# Altium schematic sheet Driver Circuit.SchDoc
size A3; DocumentNumber: 1; SheetNumber: 1; SheetTotal: 1
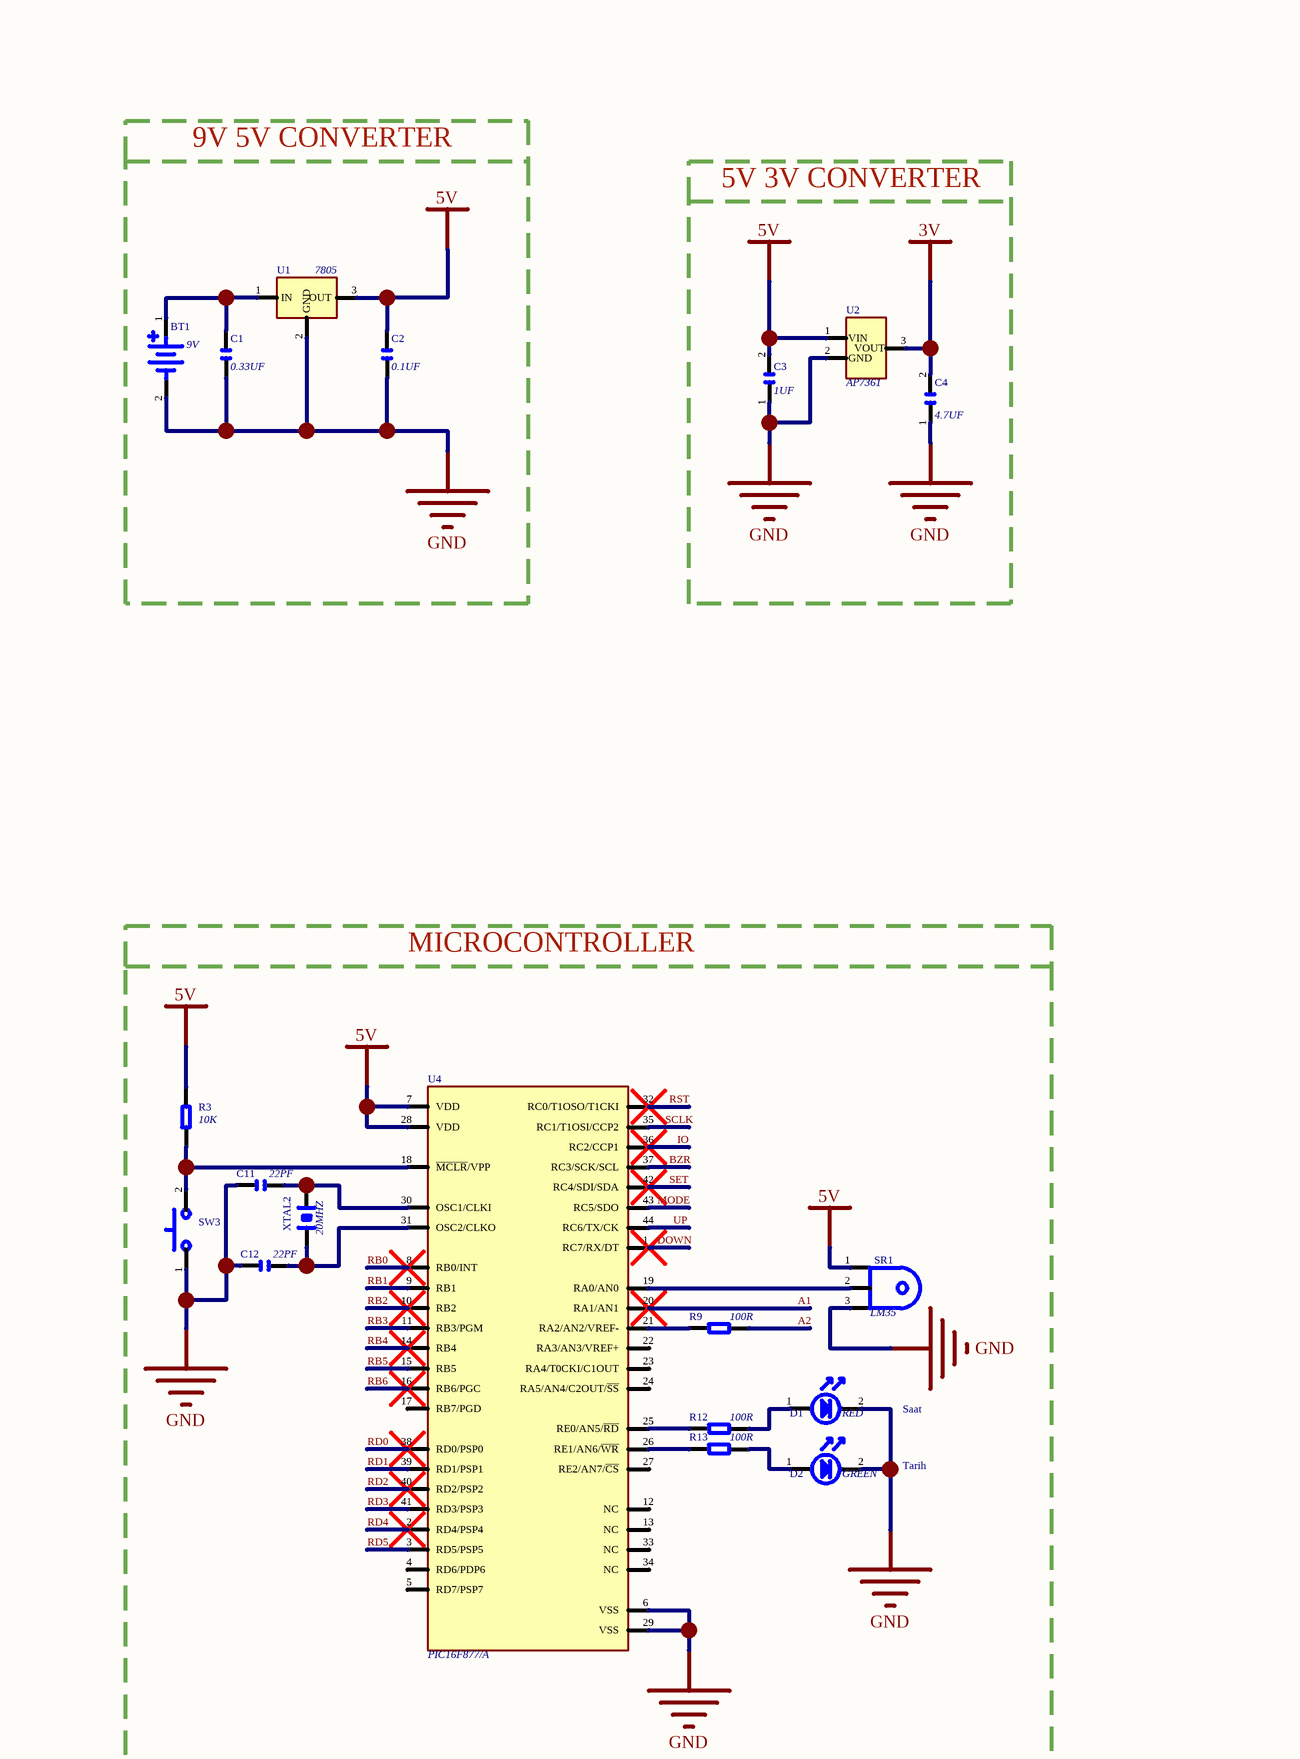
[diagram p0: Driver Circuit.SchDoc, top left]
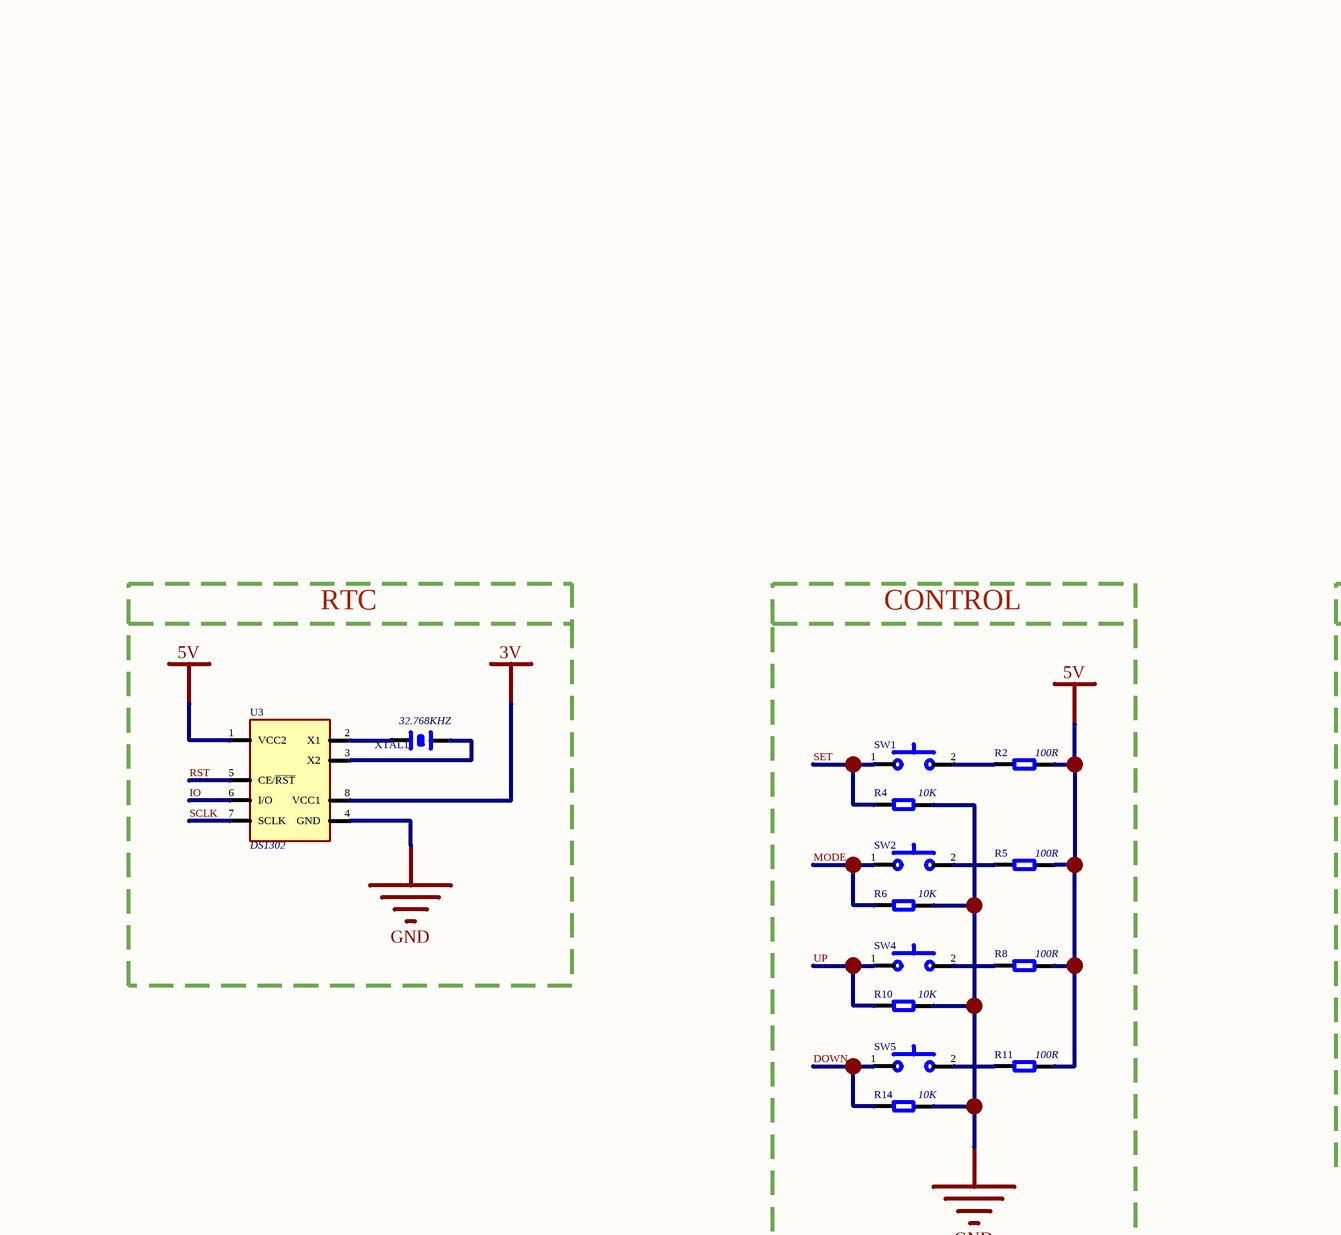
[diagram p1: Driver Circuit.SchDoc, top middle]
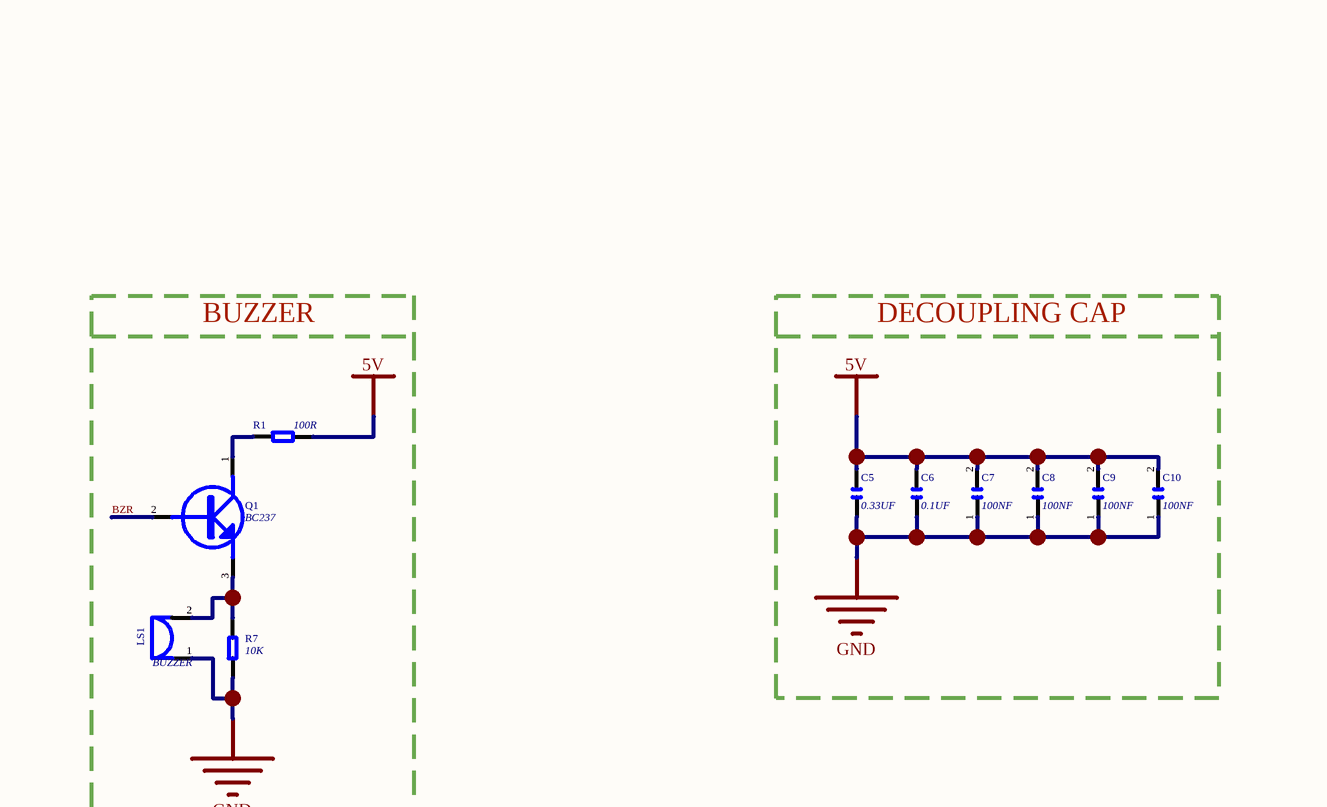
[diagram p2: Driver Circuit.SchDoc, top right]
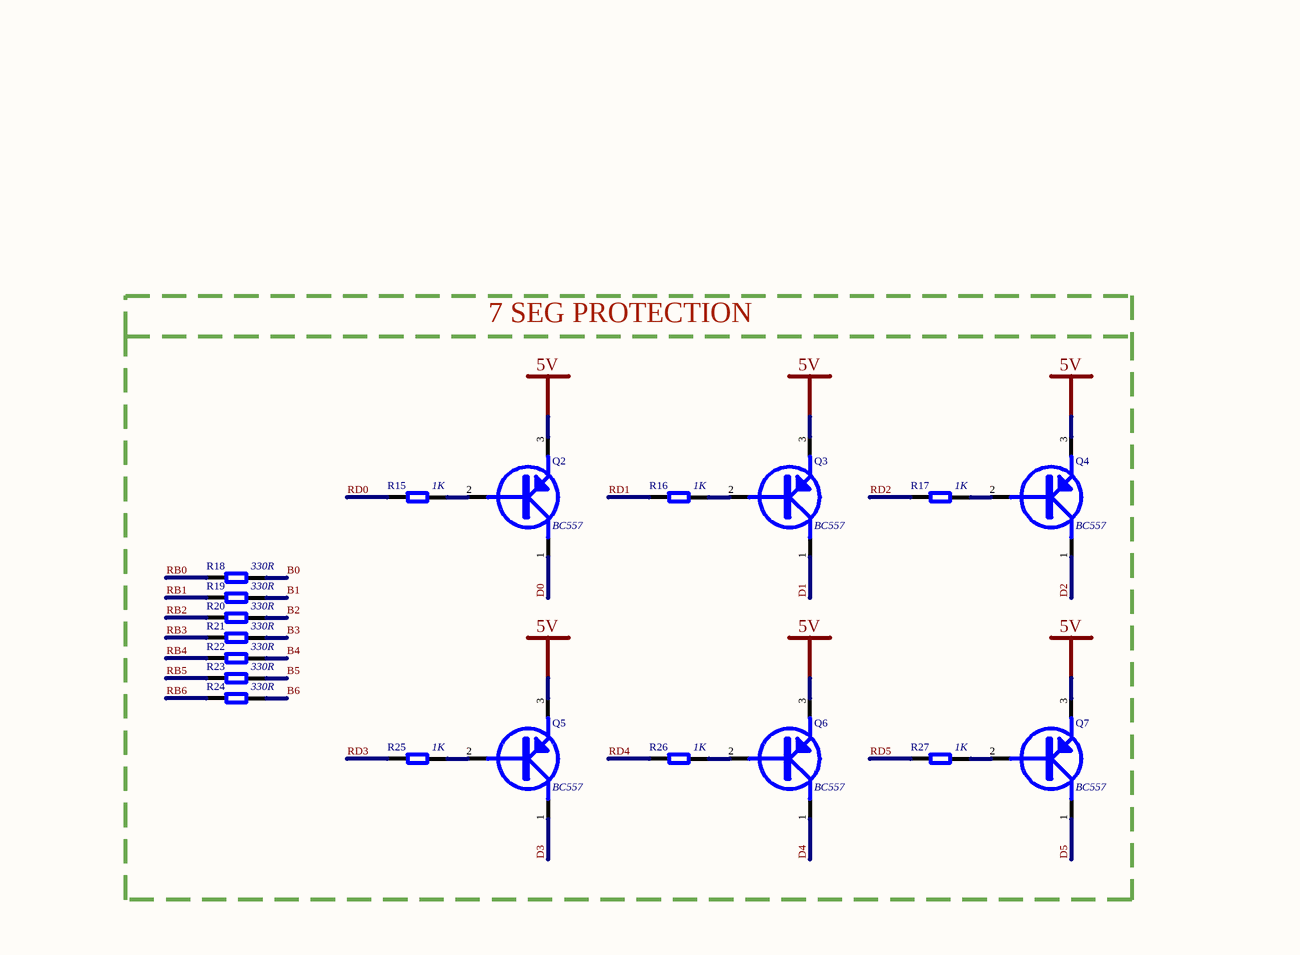
[diagram p3: Driver Circuit.SchDoc, centre left]
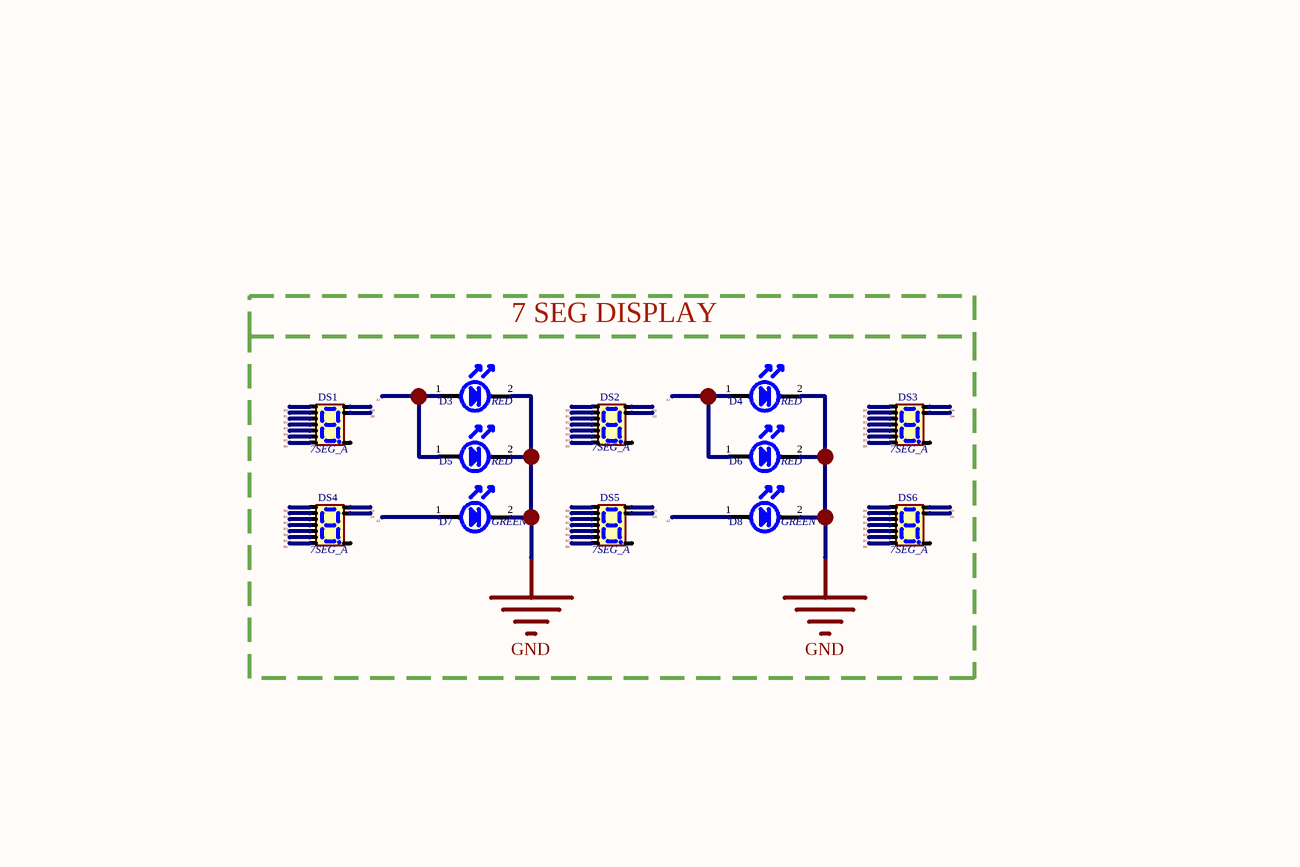
[diagram p4: Driver Circuit.SchDoc, centre middle]
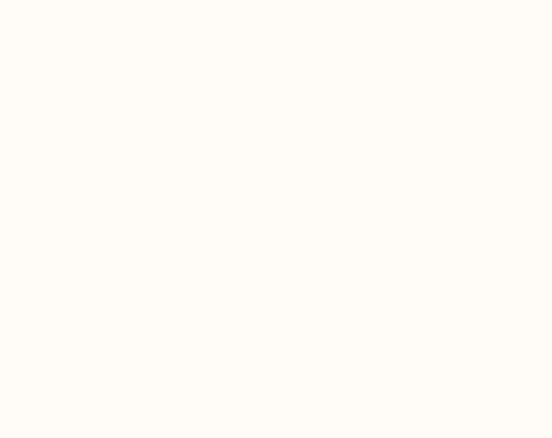
[diagram p5: Driver Circuit.SchDoc, bottom left]

## Parts
BT1  value 9V  [BATTERY_9V]  (hidden comment: BH9VPC & 6LF22XWA/B)
C1  Capacitor: 0.33UF  [CAP_0603]  (hidden comment: GRM033R60J334ME90D)
C2  Capacitor: 0.1UF  [CAP_0603]  (hidden comment: GRM033R60J104KE19D)
C3  Capacitor: 1UF  [CAP_0805]  (hidden comment: CL21B105KBFNNNE)
C4  Capacitor: 4.7UF  [CAP_0805]  (hidden comment: CL21A475KAQNNNE)
C5  Capacitor: 0.33UF  [CAP_0603]  (hidden comment: GRM033R60J334ME90D)
C6  Capacitor: 0.1UF  [CAP_0603]  (hidden comment: GRM033R60J104KE19D)
C7  Capacitor: 100NF  [CAP_0603]  (hidden comment: C0603C104K5RACTU)
C8  Capacitor: 100NF  [CAP_0603]  (hidden comment: C0603C104K5RACTU)
C9  Capacitor: 100NF  [CAP_0603]  (hidden comment: C0603C104K5RACTU)
C10  Capacitor: 100NF  [CAP_0603]  (hidden comment: C0603C104K5RACTU)
C11  Capacitor: 22PF  [CAP_0603]  (hidden comment: GRM0335C1H220JA01D)
C12  Capacitor: 22PF  [CAP_0603]  (hidden comment: GRM0335C1H220JA01D)
D1  Diode: RED  [LED RED_0805]  (hidden comment: LTST-C170KRKT)
D2  Diode: GREEN  [LED GREEN_0805]  (hidden comment: LTST-C171GKT)
D3  Diode: RED  [LED RED_0805]  (hidden comment: LTST-C170KRKT)
D4  Diode: RED  [LED RED_0805]  (hidden comment: LTST-C170KRKT)
D5  Diode: RED  [LED RED_0805]  (hidden comment: LTST-C170KRKT)
D6  Diode: RED  [LED RED_0805]  (hidden comment: LTST-C170KRKT)
D7  Diode: GREEN  [LED GREEN_0805]  (hidden comment: LTST-C171GKT)
D8  Diode: GREEN  [LED GREEN_0805]  (hidden comment: LTST-C171GKT)
DS1  value 7SEG_A  [7 SEG_CA_SMD_ACSX03-41]  (hidden comment: ACSA03-41SURKWA-F01)
DS2  value 7SEG_A  [7 SEG_CA_SMD_ACSX03-41]  (hidden comment: ACSA03-41SURKWA-F01)
DS3  value 7SEG_A  [7 SEG_CA_SMD_ACSX03-41]  (hidden comment: ACSA03-41SURKWA-F01)
DS4  value 7SEG_A  [7 SEG_CA_SMD_ACSX03-41]  (hidden comment: ACSA03-41SURKWA-F01)
DS5  value 7SEG_A  [7 SEG_CA_SMD_ACSX03-41]  (hidden comment: ACSA03-41SURKWA-F01)
DS6  value 7SEG_A  [7 SEG_CA_SMD_ACSX03-41]  (hidden comment: ACSA03-41SURKWA-F01)
LS1  value BUZZER  [BUZZER_5V]  (hidden comment: AI-1027-TWT-5V-R)
Q1  value BC237  [TO-92]  (hidden comment: BC237G)
Q2  value BC557  [TO-92-3]  (hidden comment: BC557BTA)
Q3  value BC557  [TO-92-3]  (hidden comment: BC557BTA)
Q4  value BC557  [TO-92-3]  (hidden comment: BC557BTA)
Q5  value BC557  [TO-92-3]  (hidden comment: BC557BTA)
Q6  value BC557  [TO-92-3]  (hidden comment: BC557BTA)
Q7  value BC557  [TO-92-3]  (hidden comment: BC557BTA)
R1  Resistor: 100R  [RES_0603]  (hidden comment: RC0603JR-07100RL)
R2  Resistor: 100R  [RES_0603]  (hidden comment: RC0603JR-07100RL)
R3  Resistor: 10K  [RES_0603]  (hidden comment: RC0603FR-0710KL)
R4  Resistor: 10K  [RES_0603]  (hidden comment: RC0603FR-0710KL)
R5  Resistor: 100R  [RES_0603]  (hidden comment: RC0603JR-07100RL)
R6  Resistor: 10K  [RES_0603]  (hidden comment: RC0603FR-0710KL)
R7  Resistor: 10K  [RES_0603]  (hidden comment: RC0603FR-0710KL)
R8  Resistor: 100R  [RES_0603]  (hidden comment: RC0603JR-07100RL)
R9  Resistor: 100R  [RES_0603]  (hidden comment: RC0603JR-07100RL)
R10  Resistor: 10K  [RES_0603]  (hidden comment: RC0603FR-0710KL)
R11  Resistor: 100R  [RES_0603]  (hidden comment: RC0603JR-07100RL)
R12  Resistor: 100R  [RES_0603]  (hidden comment: RC0603JR-07100RL)
R13  Resistor: 100R  [RES_0603]  (hidden comment: RC0603JR-07100RL)
R14  Resistor: 10K  [RES_0603]  (hidden comment: RC0603FR-0710KL)
R15  Resistor: 1K  [RES_0603]  (hidden comment: RC0603FR-071KL)
R16  Resistor: 1K  [RES_0603]  (hidden comment: RC0603FR-071KL)
R17  Resistor: 1K  [RES_0603]  (hidden comment: RC0603FR-071KL)
R18  Resistor: 330R  [RES_0603]  (hidden comment: RC0603JR-07330RL)
R19  Resistor: 330R  [RES_0603]  (hidden comment: RC0603JR-07330RL)
R20  Resistor: 330R  [RES_0603]  (hidden comment: RC0603JR-07330RL)
R21  Resistor: 330R  [RES_0603]  (hidden comment: RC0603JR-07330RL)
R22  Resistor: 330R  [RES_0603]  (hidden comment: RC0603JR-07330RL)
R23  Resistor: 330R  [RES_0603]  (hidden comment: RC0603JR-07330RL)
R24  Resistor: 330R  [RES_0603]  (hidden comment: RC0603JR-07330RL)
R25  Resistor: 1K  [RES_0603]  (hidden comment: RC0603FR-071KL)
R26  Resistor: 1K  [RES_0603]  (hidden comment: RC0603FR-071KL)
R27  Resistor: 1K  [RES_0603]  (hidden comment: RC0603FR-071KL)
SR1  value LM35  [TO-92-3]  (hidden comment: LM35DZ/NOPB)
SW1  PTS526 SMG15 SMTR2 LFS  [BUTTON_SMD_PTS526-SMG15]  (value not drawn)
SW2  PTS526 SMG15 SMTR2 LFS  [BUTTON_SMD_PTS526-SMG15]  (value not drawn)
SW3  PTS526 SMG15 SMTR2 LFS  [BUTTON_SMD_PTS526-SMG15]  (value not drawn)
SW4  PTS526 SMG15 SMTR2 LFS  [BUTTON_SMD_PTS526-SMG15]  (value not drawn)
SW5  PTS526 SMG15 SMTR2 LFS  [BUTTON_SMD_PTS526-SMG15]  (value not drawn)
U1  value 7805  [7805_D2PAK_CD2T]  (hidden comment: L7805ACD2T-TR)
U2  value AP7361  [SOT-223]  (hidden comment: AP7361-33E-13)
U3  value DS1302  [SOIC-8]  (hidden comment: DS1302Z+T&R)
U4  value PIC16F877/A  [TQFP-44]  (hidden comment: PIC16F877-20/PT)
XTAL1  Crystal: 32.768KHZ  [ABS05]  (hidden comment: ABS05-32.768KHZ-T)
XTAL2  Crystal: 20MHZ  [CRYSTAL_2 SMD]  (hidden comment: ECS-200-20-23A-EN-TR)

## Blocks framed on the sheet
9V 5V CONVERTER: BT1 C1 C2 U1
5V 3V CONVERTER: C3 C4 U2
MICROCONTROLLER: C11 C12 D1 D2 R3 R9 R12 R13 SR1 SW3 U4 XTAL2
RTC: U3 XTAL1
CONTROL: R2 R4-R6 R8 R10 R11 R14 SW1 SW2 SW4 SW5
BUZZER: LS1 Q1 R1 R7
DECOUPLING CAP: C5-C10
7 SEG PROTECTION: Q2-Q7 R15-R27
7 SEG DISPLAY: D3-D8 DS1-DS6

## Nets
3V: C4.2 U2.3(VOUT) U3.8(VCC1)
5V: C2.2 C3.2 C5.2 C6.2 C7.2 C8.2 C9.2 C10.2 Q2.3(E) Q3.3(E) Q4.3(E) Q5.3(E) Q6.3(E) Q7.3(E) R1.2 R2.2 R3.2 R5.2 R8.2 R11.2 SR1.1(VIN) U1.3(OUT) U2.1(VIN) U3.1(VCC2) U4.7(VDD) U4.28(VDD)
GND: BT1.2(-) C1.1 C2.1 C3.1 C4.1 C5.1 C6.1 C7.1 C8.1 C9.1 C10.1 C11.1 C12.1 D1.2 D2.2 D3.2 D4.2 D5.2 D6.2 D7.2 D8.2 LS1.1(+) R4.2 R6.2 R7.1 R10.2 R14.2 SR1.3(GND) SW3.1 U1.2(GND) U2.2(GND) U3.4(GND) U4.6(VSS) U4.29(VSS)
A1: D3.1 D4.1 D5.1 D6.1 U4.20(RA1/AN1)
A2: D7.1 D8.1 R9.2
B0: DS1.A DS2.A DS3.A DS4.A DS5.A DS6.A R18.2
B1: DS1.B DS2.B DS3.B DS4.B DS5.B DS6.B R19.2
B2: DS1.C DS2.C DS3.C DS4.C DS5.C DS6.C R20.2
B3: DS1.D DS2.D DS3.D DS4.D DS5.D DS6.D R21.2
B4: DS1.E DS2.E DS3.E DS4.E DS5.E DS6.E R22.2
B5: DS1.F DS2.F DS3.F DS4.F DS5.F DS6.F R23.2
B6: DS1.G DS2.G DS3.G DS4.G DS5.G DS6.G R24.2
BZR: Q1.2(B) U4.37(RC3/SCK/SCL)
D0: DS1.VCC Q2.1(C)
D1: DS4.VCC Q3.1(C)
D2: DS2.VCC Q4.1(C)
D3: DS5.VCC Q5.1(C)
D4: DS3.VCC Q6.1(C)
D5: DS6.VCC Q7.1(C)
DOWN: R14.1 SW5.1 U4.1(RC7/RX/DT)
IO: U3.6(I/O) U4.36(RC2/CCP1)
MODE: R6.1 SW2.1 U4.43(RC5/SDO)
RB0: R18.1 U4.8(RB0/INT)
RB1: R19.1 U4.9(RB1)
RB2: R20.1 U4.10(RB2)
RB3: R21.1 U4.11(RB3/PGM)
RB4: R22.1 U4.14(RB4)
RB5: R23.1 U4.15(RB5)
RB6: R24.1 U4.16(RB6/PGC)
RD0: R15.1 U4.38(RD0/PSP0)
RD1: R16.1 U4.39(RD1/PSP1)
RD2: R17.1 U4.40(RD2/PSP2)
RD3: R25.1 U4.41(RD3/PSP3)
RD4: R26.1 U4.2(RD4/PSP4)
RD5: R27.1 U4.3(RD5/PSP5)
RST: U3.5(CE/~{RST}) U4.32(RC0/T1OSO/T1CKI)
SCLK: U3.7(SCLK) U4.35(RC1/T1OSI/CCP2)
SET: R4.1 SW1.1 U4.42(RC4/SDI/SDA)
UP: R10.1 SW4.1 U4.44(RC6/TX/CK)
NetBT1_1: BT1.1(+) C1.2 U1.1(IN)
NetC11_2: C11.2 U4.30(OSC1/CLKI) XTAL2.2
NetC12_2: C12.2 U4.31(OSC2/CLKO) XTAL2.1
NetD1_1: D1.1 R12.2
NetD2_1: D2.1 R13.2
NetLS1_2: LS1.2(-) Q1.3(E) R7.2
NetQ1_1: Q1.1(C) R1.1
NetQ2_2: Q2.2(B) R15.2
NetQ3_2: Q3.2(B) R16.2
NetQ4_2: Q4.2(B) R17.2
NetQ5_2: Q5.2(B) R25.2
NetQ6_2: Q6.2(B) R26.2
NetQ7_2: Q7.2(B) R27.2
NetR2_1: R2.1 SW1.2
NetR3_1: R3.1 SW3.2 U4.18(~{MCLR}/VPP)
NetR5_1: R5.1 SW2.2
NetR8_1: R8.1 SW4.2
NetR9_1: R9.1 U4.21(RA2/AN2/VREF-)
NetR11_1: R11.1 SW5.2
NetR12_1: R12.1 U4.25(RE0/AN5/~{RD})
NetR13_1: R13.1 U4.26(RE1/AN6/~{WR})
NetSR1_2: SR1.2(VOUT) U4.19(RA0/AN0)
NetU3_2: U3.2(X1) XTAL1.1
NetU3_3: U3.3(X2) XTAL1.2

Not connected (* = marked no-connect by the designer): DS1 DP; DS2 DP; DS3 DP; DS4 DP; DS5 DP; DS6 DP; U4 4(RD6/PDP6) 5(RD7/PSP7) 12(NC) 13(NC) 17(RB7/PGD) 22(RA3/AN3/VREF+) 23(RA4/T0CKI/C1OUT) 24(RA5/AN4/C2OUT/~{SS}) 27(RE2/AN7/~{CS}) 33(NC) 34(NC)

## Notes on the sheet
- Saat
- Tarih
- Tanım/Description
- Hazırlayan/Prepared By
- Kontrol Eden/Checked By
- Değiştirme Tarihi/Change Date
- Yayın Tarihi/Release Date
- Mehmet Ali
- Onaylayan/Approved By
- Revizyon/Revision
- Hayta
- Bölüm/Department
- Dosya Adı/File Name
- Electronics&Hardware
- Boyut/Size
- Sayfa/Sheet
- A-3
- /

## Library data of the parts
BT1 = BATTERY_9V: Battery Holder (Open) 9V 1 Cell PC Pin &   9V Alkaline Manganese Dioxide 9 V Battery Non-Rechargeable (Primary); Manufacturer: Memory Protection Devices; Number of Cells: 1; Supplier 1: Digi-Key; Manufacturer Part Number: BH9VPC; RoHS: Yes; Category: Connectors; Stock 1: 5860; Pricing 1: 1=2,27000, 10=1,91300, 50=1,68160, 100=1,58450, 250=1,45744, 500=1,36774, 1000=1,27805, 2500=1,15847, 5000=1,06131 (USD); Mount: Surface Mount,PCB,Through Hole; Min Operating Temperature: -40°C; Max Operating Temperature: 270°C; Package Quantity: 100; Termination: SMD/SMT; ComponentLink1URL: https://datasheet.ciiva.com/3/bh9vpc-datasheet-3862.pdf?src-supplier=Digi-Key; ComponentLink1Description: https://datasheet.ciiva.com/3/bh9vpc-datasheet-3862.pdf?src-supplier=Digi-Key; Supplier 2: Digi-Key; Stock 2: 21288; Pricing 2: 1=1,98000, 20=1,64650, 210=1,35500, 420=1,26048, 630=1,18957, 1050=1,11868, 2520=1,04777 (USD); Weight: 45.59g; Chemistry/Technology: Alkaline; Packaging: Bulk; Output Voltage: 9V; Voltage Rating: 9V; Length: 1.91inch; Width: 0.51inch; Height: 0.69inch; Lead Free: Lead Free; ComponentLink2URL: http://www.mouser.com/ds/2/315/panasonic_alkaline_batteries_9v_series_6lf22xwa-541606.pdf?src-supplier=Mouser; ComponentLink2Description: http://www.mouser.com/ds/2/315/panasonic_alkaline_batteries_9v_series_6lf22xwa-541606.pdf?src-supplier=Mouser; ComponentLink3URL: https://na.industrial.panasonic.com/sites/default/pidsa/files/downloads/files/panasonic-6lf22xwa-datasheet.pdf?src-supplier=Digi-Key; ComponentLink3Description: https://na.industrial.panasonic.com/sites/default/pidsa/files/downloads/files/panasonic-6lf22xwa-datasheet.pdf?src-supplier=Digi-Key; Supplier Part Number 2: P687-ND; Supplier Part Number 1: BH9V-PC-ND
C1 C5 = 0603_CAP_CER  UF_0.33: CAP CER 0.33UF %20 0603 SMD; Manufacturer: Murata; Capacitance: 330nF; Tolerance: 20%; Dielectric: X5R; Voltage Rating (DC): 6.3V; Supplier 1: Digi-Key; Manufacturer Part Number: GRM033R60J334ME90D; RoHS: Yes; Category: Ceramic Capacitors; Stock 1: 1061917; Pricing 1: 1=0,12000, 10=0,08400, 50=0,04740, 100=0,03930, 500=0,02754, 1000=0,02280, 2500=0,02122, 5000=0,01941 (USD); Mount: Surface Mount; Case/Package: 0201; Case Code (Metric): 0603; Case Code (Imperial): 0201; Weight: 1.2E-05oz; Min Operating Temperature: -55°C; Max Operating Temperature: 85°C; Packaging: Tape and Reel; Voltage Rating: 6.3V; Termination: SMD/SMT; Package Quantity: 15000; Length: 0.024inch; Width: 0.012inch; Height: 0.3mm; Thickness: 0.013inch; RoHS Compliant: Yes; ComponentLink1URL: http://www.farnell.com/datasheets/2722735.pdf?src-supplier=Farnell; ComponentLink1Description: http://www.farnell.com/datasheets/2722735.pdf?src-supplier=Farnell; ComponentLink2URL: http://www.mouser.com/ds/2/281/c02e-2905.pdf?src-supplier=Mouser; ComponentLink2Description: http://www.mouser.com/ds/2/281/c02e-2905.pdf?src-supplier=Mouser; ComponentLink3URL: http://search.murata.co.jp/Ceramy/image/img/A01X/G101/ENG/GRM033R60J334ME90-01.pdf?src-supplier=Digi-Key; ComponentLink3Description: http://search.murata.co.jp/Ceramy/image/img/A01X/G101/ENG/GRM033R60J334ME90-01.pdf?src-supplier=Digi-Key; ComponentLink4URL: http://www.farnell.com/datasheets/2722735.pdf?src-supplier=Newark; ComponentLink4Description: http://www.farnell.com/datasheets/2722735.pdf?src-supplier=Newark; Supplier Part Number 1: 490-10408-1-ND
C2 C6 = 0603_CAP_CER  UF_0.1: CAP CER 0.1UF %10 0603 SMD; Manufacturer: Murata; Material: Ceramic; Tolerance: 10%; Capacitance: 100nF; Dielectric: X5R; Voltage Rating: 6.3V; Supplier 1: Digi-Key; Manufacturer Part Number: GRM033R60J104KE19D; RoHS: Yes; Category: Ceramic Capacitors; Stock 1: 25268944; Pricing 1: 1=0,10000, 10=0,01900, 50=0,01060, 100=0,00860, 500=0,00614, 1000=0,00482, 2500=0,00438, 5000=0,00403 (USD); Mount: Surface Mount; Case/Package: 0201; Case Code (Metric): 0603; Case Code (Imperial): 0201; Weight: 6E-06oz; Min Operating Temperature: -55°C; Max Operating Temperature: 85°C; Packaging: Tape and Reel; Package Quantity: 1; Voltage Rating (DC): 6.3V; Termination: SMD/SMT; Voltage: 6.3V; Length: 0.6mm; Width: 0.012inch; Height: 0.3mm; Thickness: 0.013inch; Depth: 0.3mm; Radiation Hardening: No; REACH SVHC: No SVHC; Lead Free: Lead Free; RoHS Compliant: Yes; ComponentLink1URL: https://datasheet.ciiva.com/6072/1747434-6072404.pdf?src-supplier=Farnell; ComponentLink1Description: https://datasheet.ciiva.com/6072/1747434-6072404.pdf?src-supplier=Farnell; ComponentLink2URL: https://datasheet.ciiva.com/131/grm033r60j104ke19x-131060.pdf?src-supplier=Digi-Key; ComponentLink2Description: https://datasheet.ciiva.com/131/grm033r60j104ke19x-131060.pdf?src-supplier=Digi-Key; ComponentLink3URL: https://datasheet.ciiva.com/5420/product-5420533.pdf?src-supplier=Mouser; ComponentLink3Description: https://datasheet.ciiva.com/5420/product-5420533.pdf?src-supplier=Mouser; ComponentLink4URL: https://datasheet.ciiva.com/18101/getdatasheetpartid-56050-18101730.pdf?src-supplier=Verical; ComponentLink4Description: https://datasheet.ciiva.com/18101/getdatasheetpartid-56050-18101730.pdf?src-supplier=Verical; ComponentLink5URL: https://datasheet.ciiva.com/29199/455624-da-01-en-vs-kondensator-0201-29199254.pdf?src-supplier=Conrad; ComponentLink5Description: https://datasheet.ciiva.com/29199/455624-da-01-en-vs-kondensator-0201-29199254.pdf?src-supplier=Conrad; ComponentLink6URL: https://datasheet.ciiva.com/7718/1747434-7718974.pdf?src-supplier=Element14; ComponentLink6Description: https://datasheet.ciiva.com/7718/1747434-7718974.pdf?src-supplier=Element14; ComponentLink7URL: https://datasheet.ciiva.com/7718/1747434-7718973.pdf?src-supplier=Element14; ComponentLink7Description: https://datasheet.ciiva.com/7718/1747434-7718973.pdf?src-supplier=Element14; ComponentLink8URL: https://datasheet.ciiva.com/131/grm033r60j104ke19-01-131062.pdf?src-supplier=Digi-Key; ComponentLink8Description: https://datasheet.ciiva.com/131/grm033r60j104ke19-01-131062.pdf?src-supplier=Digi-Key; ComponentLink9URL: https://datasheet.ciiva.com/24157/product-24157402.pdf?src-supplier=Future+Electronics; ComponentLink9Description: https://datasheet.ciiva.com/24157/product-24157402.pdf?src-supplier=Future+Electronics; Supplier Part Number 1: 490-3167-1-ND
C3 = 0805_CAP_CER  UF_1: CAP CER 1UF %10 0805 SMD
C4 = 0805_CAP_CER  UF_4.7: CAP CER 4.7UF %10 0805 SMD
C7-C10 = 0603_CAP_CER  NF_100: CAP CER 100NF %10 0603 SMD
C11 C12 = 0603_CAP_CER  PF_22: CAP CER 22PF %5 0603 SMD; Manufacturer: Murata; Voltage Rating: 50V; Tolerance: 5%; Dielectric: C0G; Supplier 1: Digi-Key; Manufacturer Part Number: GRM0335C1H220JA01D; RoHS: Yes; Category: Ceramic Capacitors; Stock 1: 1262569; Pricing 1: 1=0,10000, 10=0,01400, 50=0,00760, 100=0,00620, 500=0,00440, 1000=0,00346, 2500=0,00315, 5000=0,00290 (USD); Mount: Surface Mount; Case/Package: 0201; Case Code (Metric): 0603; Case Code (Imperial): 0201; Min Operating Temperature: -55°C; Max Operating Temperature: 125°C; Package Quantity: 15000; Capacitance: 22pF; Packaging: Tape and Reel; Termination: SMD/SMT; Voltage: 50V; Voltage Rating (DC): 50V; Series: GRM; Length: 0.6mm; Width: 0.012inch; Height: 0.3mm; Thickness: 0.013inch; Depth: 0.3mm; Lead Free: Lead Free; RoHS Compliant: Yes; ComponentLink1URL: https://datasheet.ciiva.com/6271/partnumbering-e-01-6271146.pdf?src-supplier=Digi-Key; ComponentLink1Description: https://datasheet.ciiva.com/6271/partnumbering-e-01-6271146.pdf?src-supplier=Digi-Key; ComponentLink2URL: https://datasheet.ciiva.com/6271/partnumbering-e-01-6271143.pdf?src-supplier=Digi-Key; ComponentLink2Description: https://datasheet.ciiva.com/6271/partnumbering-e-01-6271143.pdf?src-supplier=Digi-Key; ComponentLink3URL: https://datasheet.ciiva.com/6271/partnumbering-e-01-6271149.pdf?src-supplier=Digi-Key; ComponentLink3Description: https://datasheet.ciiva.com/6271/partnumbering-e-01-6271149.pdf?src-supplier=Digi-Key; Supplier Part Number 1: 490-6123-1-ND
D1 D3-D6 = LED_0805_RED: Red 631nm LED Indication - Discrete 2V 0805 (2012 Metric); Manufacturer: Vishay Lite-On; Lens Color: Colorless; Forward Current: 30mA; Power Rating: 75mW; Luminous Intensity: 54mcd; Viewing Angle: 130°; Lens Style: Clear,Diffused,Colorless,Rectangular; Test Current: 20mA; Lens Transparency: Clear; Number of Elements: 1; Wavelength: 639nm; Reverse Voltage: 5V; Supplier 1: Digi-Key; Manufacturer Part Number: LTST-C170KRKT; RoHS: Yes; Category: LEDs; Stock 1: 699495; Pricing 1: 1=0,31000, 10=0,16900, 100=0,07860, 500=0,07260, 1000=0,05687 (USD); Mount: Surface Mount; Case/Package: 0805; Number of Pins: 2; Color: Red; Case Code (Metric): 2012; Case Code (Imperial): 0805; Min Operating Temperature: -55°C; Max Operating Temperature: 85°C; Illumination Color: Red; Forward Voltage: 2V; Packaging: Tape and Reel; Package Quantity: 1; Dominant Wavelength: 631nm; Power Dissipation: 75mW; Number of LEDs: 1; Series: CHIPLED 0805; Length: 3.2mm; Width: 1.25mm; Height: 1.1mm; Depth: 1.6mm; Radiation Hardening: No; Lead Free: Lead Free; RoHS Compliant: Yes; ComponentLink1URL: https://datasheet.ciiva.com/11775/0900766b80dc027b-11775642.pdf?src-supplier=RSComponents; ComponentLink1Description: https://datasheet.ciiva.com/11775/0900766b80dc027b-11775642.pdf?src-supplier=RSComponents; ComponentLink2URL: https://datasheet.ciiva.com/12403/lite-on-ltst-c170krkt-187374-12403917.pdf?src-supplier=Mouser; ComponentLink2Description: https://datasheet.ciiva.com/12403/lite-on-ltst-c170krkt-187374-12403917.pdf?src-supplier=Mouser; ComponentLink3URL: https://datasheet.ciiva.com/16362/lite-on20ltst-c170krkt-16362852.pdf?src-supplier=Future+Electronics; ComponentLink3Description: https://datasheet.ciiva.com/16362/lite-on20ltst-c170krkt-16362852.pdf?src-supplier=Future+Electronics; ComponentLink4URL: https://datasheet.ciiva.com/15117/getdatasheetpartid-103842-15117442.pdf?src-supplier=Verical; ComponentLink4Description: https://datasheet.ciiva.com/15117/getdatasheetpartid-103842-15117442.pdf?src-supplier=Verical; ComponentLink5URL: https://datasheet.ciiva.com/2110/s-110-ltst-c170krkt-2110037.pdf?src-supplier=Digi-Key; ComponentLink5Description: https://datasheet.ciiva.com/2110/s-110-ltst-c170krkt-2110037.pdf?src-supplier=Digi-Key; ComponentLink6URL: https://datasheet.ciiva.com/2110/s-110-ltst-c170krkt-2110036.pdf?src-supplier=Digi-Key; ComponentLink6Description: https://datasheet.ciiva.com/2110/s-110-ltst-c170krkt-2110036.pdf?src-supplier=Digi-Key; ComponentLink7URL: https://datasheet.ciiva.com/2110/s-110-ltst-c170krkt-2110038.pdf?src-supplier=Digi-Key; ComponentLink7Description: https://datasheet.ciiva.com/2110/s-110-ltst-c170krkt-2110038.pdf?src-supplier=Digi-Key; Supplier Part Number 1: 160-1415-1-ND
D2 D7 D8 = LED_0805_GREEN: Green 569nm LED Indication - Discrete 2.1V 0805 (2012 Metric); Manufacturer: Vishay Lite-On; Lens Color: Colorless; Viewing Angle: 130°; Lens Style: Diffused,Colorless,Rectangular,Clear; Luminous Intensity: 12mcd; Forward Current: 30mA; Power Rating: 100mW; Test Current: 10mA; Lens Transparency: Clear; Number of Elements: 1; Wavelength: 585nm; Reverse Voltage: 5V; Supplier 1: Digi-Key; Manufacturer Part Number: LTST-C171GKT; RoHS: Yes; Category: LEDs; Stock 1: 470042; Pricing 1: 1=0,26000, 10=0,14100, 100=0,06560, 500=0,06060, 1000=0,04747 (USD); Mount: Surface Mount; Case/Package: 0805; Number of Pins: 2; Color: Green; Case Code (Metric): 2012; Case Code (Imperial): 0805; Min Operating Temperature: -55°C; Max Operating Temperature: 85°C; Package Quantity: 1; Packaging: Tape and Reel; Forward Voltage: 2.1V; Illumination Color: Green; Dominant Wavelength: 569nm; Power Dissipation: 100mW; Number of LEDs: 1; Series: CHIPLED 0805; Length: 2mm; Width: 1.25mm; Height: 0.8mm; Depth: 1.25mm; Radiation Hardening: No; Lead Free: Lead Free; RoHS Compliant: Yes; ComponentLink1URL: https://datasheet.ciiva.com/2110/ltst-c171gkt-2110000.pdf?src-supplier=Digi-Key; ComponentLink1Description: https://datasheet.ciiva.com/2110/ltst-c171gkt-2110000.pdf?src-supplier=Digi-Key; ComponentLink2URL: https://datasheet.ciiva.com/11773/0900766b80dc0296-11773991.pdf?src-supplier=RSComponents; ComponentLink2Description: https://datasheet.ciiva.com/11773/0900766b80dc0296-11773991.pdf?src-supplier=RSComponents; ComponentLink3URL: https://datasheet.ciiva.com/12400/lite-on-ltst-c171gkt-190133-12400647.pdf?src-supplier=Mouser; ComponentLink3Description: https://datasheet.ciiva.com/12400/lite-on-ltst-c171gkt-190133-12400647.pdf?src-supplier=Mouser; ComponentLink4URL: https://datasheet.ciiva.com/2110/ltst-c171gkt-2110001.pdf?src-supplier=Digi-Key; ComponentLink4Description: https://datasheet.ciiva.com/2110/ltst-c171gkt-2110001.pdf?src-supplier=Digi-Key; ComponentLink5URL: https://datasheet.ciiva.com/2110/ltst-c171gkt-2110002.pdf?src-supplier=Digi-Key; ComponentLink5Description: https://datasheet.ciiva.com/2110/ltst-c171gkt-2110002.pdf?src-supplier=Digi-Key; ComponentLink6URL: https://datasheet.ciiva.com/16396/ltst-c171gkt-16396549.pdf?src-supplier=Future+Electronics; ComponentLink6Description: https://datasheet.ciiva.com/16396/ltst-c171gkt-16396549.pdf?src-supplier=Future+Electronics; Supplier Part Number 1: 160-1423-1-ND
DS1-DS6 = 7 SEG DISP_CA_SMD: Display Modules - LED Character and Numeric Red 7-Segment 1 Character Common Anode 1.95V 20mA 0.394" H x 0.287" W x 0.148" D (10.00mm x 7.30mm x 3.75mm) 10-SMD, No Lead; Manufacturer: Kingbright; Number of Characters: 1; Max Power Dissipation: 75mW; Wavelength: 630nm; Luminous Intensity: 27mcd; Supplier 1: Digi-Key; Manufacturer Part Number: ACSA03-41SURKWA-F01; RoHS: Yes; Category: LEDs; Stock 1: 70; Pricing 1: 1=3,21000, 10=2,27100, 100=1,86020 (USD); Case/Package: SMD/SMT; Color: Red; Min Operating Temperature: -40°C; Max Operating Temperature: 85°C; Package Quantity: 550; Element Configuration: Common Anode; Illumination Color: Red; Forward Current: 20mA; Forward Voltage: 1.95V; Packaging: Tape and Reel; Power Consumption: 75mW; Test Current: 20mA; Display Type: Segment; Operating Supply Voltage: 1.95V; Width: 0.287inch; Height: 0.394inch; Lead Free: Lead Free; RoHS Compliant: Yes; ComponentLink1URL: https://datasheet.ciiva.com/2104/acsa03-41surkwa-f01-2104880.pdf?src-supplier=Digi-Key; ComponentLink1Description: https://datasheet.ciiva.com/2104/acsa03-41surkwa-f01-2104880.pdf?src-supplier=Digi-Key; ComponentLink2URL: https://datasheet.ciiva.com/16411/acsa03-41surkwa-f01-16411419.pdf?src-supplier=Future+Electronics; ComponentLink2Description: https://datasheet.ciiva.com/16411/acsa03-41surkwa-f01-16411419.pdf?src-supplier=Future+Electronics; Supplier Part Number 1: 754-2231-1-ND
LS1 = BUZZER_5V: Buzzers Indicator, Internally Driven Electromechanical/Magnetic 5 V 30mA 2.7kHz 80dB @ 5V, 10cm Through Hole PC Pins; Manufacturer: Projects Unlimited; Max Supply Voltage (DC): 8V; Min Supply Voltage (DC): 3V; Washable: Yes; Supplier 1: Digi-Key; Manufacturer Part Number: AI-1027-TWT-5V-R; RoHS: Yes; Category: Audio Products; Stock 1: 105769; Pricing 1: 1=2,12000, 10=1,75800, 25=1,62480, 40=1,52800, 150=1,43453, 450=1,23138, 1050=1,17541 (USD); Mount: Through Hole; Contact Plating: Tin; Min Operating Temperature: -20°C; Max Operating Temperature: 80°C; Frequency: 2.7kHz; Packaging: Tray; Package Quantity: 150; Operating Supply Current: 30mA; Termination: PC Pins; Max Supply Current: 30mA; Sensing Method: Magnetic; Voltage Rating (DC): 5V; Current Rating: 30mA; Nominal Supply Voltage (DC): 5V; Diameter: 9.5mm; Length: 9.5mm; Width: 9.5mm; Height: 5mm; ComponentLink1URL: https://datasheet.ciiva.com/4623/ai-1027-twt-5v-r-70359-4623188.pdf?src-supplier=Mouser; ComponentLink1Description: https://datasheet.ciiva.com/4623/ai-1027-twt-5v-r-70359-4623188.pdf?src-supplier=Mouser; ComponentLink2URL: https://datasheet.ciiva.com/8113/ai-1027-twt-5v-r-8113492.pdf?src-supplier=Avnet; ComponentLink2Description: https://datasheet.ciiva.com/8113/ai-1027-twt-5v-r-8113492.pdf?src-supplier=Avnet; ComponentLink3URL: https://datasheet.ciiva.com/6560/ai-1027-twt-5v-r-6560933.pdf?src-supplier=Digi-Key; ComponentLink3Description: https://datasheet.ciiva.com/6560/ai-1027-twt-5v-r-6560933.pdf?src-supplier=Digi-Key; Supplier Part Number 1: 668-1339-ND
Q1 = BC237: Bipolar (BJT) Transistor NPN 45 V 100 mA 200MHz 350 mW Through Hole TO-92 (TO-226); Manufacturer: ON Semiconductor; hFE Min: 120; Max Power Dissipation: 350mW; Collector Emitter Voltage (VCEO): 600mV; Collector Base Voltage (VCBO): 50V; Emitter Base Voltage (VEBO): 6V; Collector Emitter Saturation Voltage: 200mV; Max Collector Current: 100mA; Collector Emitter Breakdown Voltage: 45V; Element Configuration: Single; Supplier 1: Digi-Key; Manufacturer Part Number: BC237G; RoHS: Yes; Category: BJTs; Mount: Through Hole; Case/Package: TO-92-3; Min Operating Temperature: -55°C; Max Operating Temperature: 150°C; Packaging: Bulk; Package Quantity: 5000; Polarity: NPN; Continuous Collector Current: 100mA; Transition Frequency: 200MHz; Gain Bandwidth Product: 200MHz; Current Rating: 100mA; Voltage Rating (DC): 45V; Collector-emitter Voltage-Max: 600mV; Series: -; Lead Free: Lead Free; RoHS Compliant: Yes; ComponentLink1URL: https://datasheet.ciiva.com/985/bc237b-c-239c-985935.pdf?src-supplier=Digi-Key; ComponentLink1Description: https://datasheet.ciiva.com/985/bc237b-c-239c-985935.pdf?src-supplier=Digi-Key; Supplier Part Number 1: BC237G-ND
Q2-Q7 = BC557: Trans GP BJT PNP 45V 0.1A 500mW 3-Pin TO-92 Fan-Fold; Manufacturer: ON Semiconductor / Fairchild; Frequency: 150MHz; hFE Min: 110; Number of Elements: 1; Max Collector Current: 100mA; Collector Base Voltage (VCBO): -50V; Emitter Base Voltage (VEBO): -5V; Collector Emitter Saturation Voltage: -250mV; Element Configuration: Single; Collector-emitter Voltage-Max: 650mV; Voltage Rating (DC): -45V; Current Rating: -100mA; Supplier 1: Digi-Key; Manufacturer Part Number: BC557BTA; RoHS: Yes; Category: BJTs; Stock 1: 13151; Pricing 1: 1=0,36000, 10=0,29700, 100=0,15770, 500=0,10374, 1000=0,07055 (USD); Mount: Through Hole; Case/Package: TO-92; Number of Pins: 3; Weight: 0.24g; Contact Plating: Tin,Matte; Min Operating Temperature: -65°C; Max Operating Temperature: 150°C; Max Power Dissipation: 500mW; Package Quantity: 1; Collector Emitter Voltage (VCEO): 45V; Packaging: Ammo Pack; Polarity: PNP; Transition Frequency: 150MHz; Collector Emitter Breakdown Voltage: 45V; Power Dissipation: 500mW; Gain Bandwidth Product: 150MHz; Series: -; Max Breakdown Voltage: 45V; Max Frequency: 150MHz; Length: 4.58mm; Width: 3.86mm; Height: 4.58mm; Radiation Hardening: No; RoHS Compliant: Yes; REACH SVHC: No SVHC; Lead Free: Lead Free; ComponentLink1URL: https://datasheet.ciiva.com/25625/0900766b810e1cf8-25625979.pdf?src-supplier=RSComponents; ComponentLink1Description: https://datasheet.ciiva.com/25625/0900766b810e1cf8-25625979.pdf?src-supplier=RSComponents; ComponentLink2URL: https://datasheet.ciiva.com/4722/bc557-193968-4722128.pdf?src-supplier=Mouser; ComponentLink2Description: https://datasheet.ciiva.com/4722/bc557-193968-4722128.pdf?src-supplier=Mouser; ComponentLink3URL: https://datasheet.ciiva.com/11205/bc559-11205941.pdf?src-supplier=Avnet; ComponentLink3Description: https://datasheet.ciiva.com/11205/bc559-11205941.pdf?src-supplier=Avnet; ComponentLink4URL: https://datasheet.ciiva.com/971/bc556-971945.pdf?src-supplier=Digi-Key; ComponentLink4Description: https://datasheet.ciiva.com/971/bc556-971945.pdf?src-supplier=Digi-Key; ComponentLink5URL: https://datasheet.ciiva.com/6356/bc556-6356078.pdf?src-supplier=Digi-Key; ComponentLink5Description: https://datasheet.ciiva.com/6356/bc556-6356078.pdf?src-supplier=Digi-Key; ComponentLink6URL: https://datasheet.ciiva.com/46415/1817587-46415452.pdf?src-supplier=Element14; ComponentLink6Description: https://datasheet.ciiva.com/46415/1817587-46415452.pdf?src-supplier=Element14; Supplier Part Number 1: BC557BTACT-ND
R1 R2 R5 R8 R9 R11-R13 = 0603_RES  R_100: RES 100R %5 0603 SMD; Manufacturer: Yageo; Tolerance: 5%; Temperature Coefficient: 100ppm/°C; Voltage Rating (DC): 50V; Power Rating: 100mW; Supplier 1: Digi-Key; Manufacturer Part Number: RC0603JR-07100RL; RoHS: Yes; Category: Chip SMD Resistors; Stock 1: 4159902; Pricing 1: 1=0,10000, 10=0,01900, 100=0,00770, 1000=0,00344, 2500=0,00298 (USD); Case/Package: 0603; Number of Pins: 2; Contact Plating: Tin,Matte; Case Code (Imperial): 0603; Case Code (Metric): 1608; Size Code: 0603; Min Operating Temperature: -55°C; Max Operating Temperature: 155°C; Resistance: 100R; Resistor Type: Thick Film; Packaging: Tape and Reel; Voltage Rating: 50V; Termination: SMD/SMT; Features: Moisture Resistant; Series: RC; Max Power Dissipation: 100mW; Number of Terminations: 2; Construction: Rectangular; Resistance Tolerance: 5%; Length: 1.6mm; Width: 0.8mm; Depth: 0.8mm; Radiation Hardening: No; REACH SVHC: Unknown; Lead Free: Lead Free; Military Standard: Not; RoHS Compliant: Yes; ComponentLink1URL: https://datasheet.ciiva.com/7746/443971-7746425.pdf?src-supplier=Element14; ComponentLink1Description: https://datasheet.ciiva.com/7746/443971-7746425.pdf?src-supplier=Element14; ComponentLink2URL: https://datasheet.ciiva.com/7746/443971-7746426.pdf?src-supplier=Element14; ComponentLink2Description: https://datasheet.ciiva.com/7746/443971-7746426.pdf?src-supplier=Element14; ComponentLink3URL: https://datasheet.ciiva.com/8883/pyu-rc0603-51-rohs-l-4-8883047.pdf?src-supplier=Avnet; ComponentLink3Description: https://datasheet.ciiva.com/8883/pyu-rc0603-51-rohs-l-4-8883047.pdf?src-supplier=Avnet; ComponentLink4URL: https://datasheet.ciiva.com/15189/getdatasheetpartid-325207-15189846.pdf?src-supplier=Verical; ComponentLink4Description: https://datasheet.ciiva.com/15189/getdatasheetpartid-325207-15189846.pdf?src-supplier=Verical; Supplier Part Number 1: 311-100GRCT-ND
R3 R4 R6 R7 R10 R14 = 0603_RES  K_10: RES 10K %1 0603 SMD; Manufacturer: Yageo; Tolerance: 1%; Resistance: 10kR; Temperature Coefficient: 100ppm/°C; Voltage Rating (DC): 50V; Power Rating: 100mW; Voltage Rating: 75V; Supplier 1: Digi-Key; Manufacturer Part Number: RC0603FR-0710KL; RoHS: Yes; Category: Chip SMD Resistors; Stock 1: 47599943; Pricing 1: 1=0,10000, 10=0,02300, 100=0,00930, 1000=0,00417, 2500=0,00362 (USD); Case/Package: 0603; Number of Pins: 2; Case Code (Imperial): 0603; Case Code (Metric): 1608; Weight: 7.1E-05oz; Size Code: 0603; Min Operating Temperature: -55°C; Max Operating Temperature: 155°C; Resistor Type: Thick Film; Packaging: Tape and Reel; Termination: SMD/SMT; Features: Moisture Resistant; Series: RC; Max Power Dissipation: 100mW; Number of Terminations: 2; Resistance Tolerance: 1%; Construction: Rectangular; Length: 1.6mm; Width: 0.8mm; Height: 0.45mm; Depth: 0.8mm; Lead Pitch: 0.3mm; REACH SVHC: Unknown; Lead Free: Lead Free; Military Standard: Not; RoHS Compliant: Yes; ComponentLink1URL: https://datasheet.ciiva.com/7660/38590-7660789.pdf?src-supplier=Element14; ComponentLink1Description: https://datasheet.ciiva.com/7660/38590-7660789.pdf?src-supplier=Element14; ComponentLink2URL: https://datasheet.ciiva.com/7983/443971-7983596.pdf?src-supplier=Element14; ComponentLink2Description: https://datasheet.ciiva.com/7983/443971-7983596.pdf?src-supplier=Element14; ComponentLink3URL: https://datasheet.ciiva.com/22747/443971-22747519.pdf?src-supplier=Element14; ComponentLink3Description: https://datasheet.ciiva.com/22747/443971-22747519.pdf?src-supplier=Element14; ComponentLink4URL: https://datasheet.ciiva.com/46440/1868787-46440891.pdf?src-supplier=Element14; ComponentLink4Description: https://datasheet.ciiva.com/46440/1868787-46440891.pdf?src-supplier=Element14; ComponentLink5URL: https://datasheet.ciiva.com/7746/1738695-7746239.pdf?src-supplier=Element14; ComponentLink5Description: https://datasheet.ciiva.com/7746/1738695-7746239.pdf?src-supplier=Element14; ComponentLink6URL: https://datasheet.ciiva.com/15189/getdatasheetpartid-409289-15189591.pdf?src-supplier=Verical; ComponentLink6Description: https://datasheet.ciiva.com/15189/getdatasheetpartid-409289-15189591.pdf?src-supplier=Verical; Supplier Part Number 1: 311-10.0KHRCT-ND
R15-R17 R25-R27 = 0603_RES  K_1: RES 1K %1 0603 SMD; Manufacturer: Yageo; Tolerance: 1%; Resistance: 1kR; Temperature Coefficient: 100ppm/°C; Power Rating: 100mW; Voltage Rating: 50V; Supplier 1: Digi-Key; Manufacturer Part Number: RC0603FR-071KL; RoHS: Yes; Category: Chip SMD Resistors; Stock 1: 9003175; Pricing 1: 1=0,10000, 10=0,02300, 100=0,00930, 1000=0,00417, 2500=0,00362 (USD); Case/Package: 0603; Contact Plating: Tin,Matte; Case Code (Imperial): 0603; Case Code (Metric): 1608; Size Code: 0603; Min Operating Temperature: -55°C; Max Operating Temperature: 155°C; Resistor Type: Thick Film; Packaging: Tape and Reel; Termination: SMD/SMT; Features: Moisture Resistant; Series: RC; Max Power Dissipation: 100mW; Number of Terminations: 2; Technology: THICK FILM; Resistance Tolerance: 1%; Construction: Rectangular; Length: 1.6mm; Height: 0.45mm; Depth: 0.8mm; Radiation Hardening: No; REACH SVHC: No SVHC; Lead Free: Lead Free; Military Standard: Not; RoHS Compliant: Yes; Supplier Part Number 1: 311-1.00KHRCT-ND
R18-R24 = 0603_RES  R_330: RES 330R %5 0603 SMD; Manufacturer: Yageo; Power Rating: 100mW; Tolerance: 5%; Voltage Rating (DC): 50V; Temperature Coefficient: 100ppm/°C; Supplier 1: Digi-Key; Manufacturer Part Number: RC0603JR-07330RL; RoHS: Yes; Category: Chip SMD Resistors; Stock 1: 4868904; Pricing 1: 1=0,10000, 10=0,01900, 100=0,00770, 1000=0,00344, 2500=0,00298 (USD); Case/Package: 0603; Number of Pins: 2; Case Code (Imperial): 0603; Case Code (Metric): 1608; Size Code: 0603; Min Operating Temperature: -55°C; Max Operating Temperature: 155°C; Resistance: 330R; Voltage Rating: 50V; Packaging: Tape and Reel; Resistor Type: Thick Film; Resistance Tolerance: 5%; Package Quantity: 5000; Termination: SMD/SMT; Features: Moisture Resistant; Series: RC; Max Power Dissipation: 100mW; Number of Terminations: 2; Construction: Rectangular; Length: 1.6mm; Width: 0.8mm; Height: 0.45mm; Depth: 0.8mm; REACH SVHC: No SVHC; Lead Free: Lead Free; RoHS Compliant: Yes; Military Standard: Not; ComponentLink1URL: https://datasheet.ciiva.com/46395/443971-46395145.pdf?src-supplier=Element14; ComponentLink1Description: https://datasheet.ciiva.com/46395/443971-46395145.pdf?src-supplier=Element14; ComponentLink2URL: https://datasheet.ciiva.com/12558/rc0603-272842-12558685.pdf?src-supplier=Mouser; ComponentLink2Description: https://datasheet.ciiva.com/12558/rc0603-272842-12558685.pdf?src-supplier=Mouser; ComponentLink3URL: https://datasheet.ciiva.com/7746/1868787-7746487.pdf?src-supplier=Element14; ComponentLink3Description: https://datasheet.ciiva.com/7746/1868787-7746487.pdf?src-supplier=Element14; ComponentLink4URL: https://datasheet.ciiva.com/7746/443971-7746488.pdf?src-supplier=Element14; ComponentLink4Description: https://datasheet.ciiva.com/7746/443971-7746488.pdf?src-supplier=Element14; ComponentLink5URL: https://datasheet.ciiva.com/15189/getdatasheetpartid-342831-15189868.pdf?src-supplier=Verical; ComponentLink5Description: https://datasheet.ciiva.com/15189/getdatasheetpartid-342831-15189868.pdf?src-supplier=Verical; Supplier Part Number 1: 311-330GRCT-ND
SR1 = LM35DZ: Temperature Sensor Analog, Local 0°C ~ 100°C 10mV/°C TO-92-3; Manufacturer: TI National Semiconductor; Output Current: 10mA; Quiescent Current: 56uA; Min Supply Voltage: 4V; Max Supply Voltage: 30V; Operating Supply Current: 91.5uA; Output Type: Voltage,Analog Voltage,Analog; Supplier 1: Digi-Key; Manufacturer Part Number: LM35DZ/NOPB; RoHS: Yes; Category: Integrated Circuits (ICs); Mount: Through Hole; Case/Package: TO-92; Number of Pins: 3; Weight: 0.01lb; Contact Plating: Tin; Min Operating Temperature: -40°C; Max Operating Temperature: 110°C; Packaging: Bulk; Package Quantity: 1800; Interface: Analog; Max Supply Voltage (DC): 30V; Min Supply Voltage (DC): 4V; Series: -; Output: ANALOG; Length: 5.2mm; Width: 4.19mm; Height: 5.2mm; Radiation Hardening: No; REACH SVHC: No SVHC; Lead Free: Lead Free; RoHS Compliant: Yes; ComponentLink1URL: https://datasheet.ciiva.com/19482/1276463-19482932.pdf?src-supplier=Jameco; ComponentLink1Description: https://datasheet.ciiva.com/19482/1276463-19482932.pdf?src-supplier=Jameco; ComponentLink2URL: https://datasheet.ciiva.com/1514/1896190-1514203.pdf?src-supplier=Element14; ComponentLink2Description: https://datasheet.ciiva.com/1514/1896190-1514203.pdf?src-supplier=Element14; ComponentLink3URL: https://datasheet.ciiva.com/6476/lm35-6476186.pdf?src-supplier=Digi-Key; ComponentLink3Description: https://datasheet.ciiva.com/6476/lm35-6476186.pdf?src-supplier=Digi-Key; Supplier 2: Arrow Electronics; Supplier 3: RSComponents; Stock 3: 2; Pricing 3: 1800=1,30300 (GBP); Supplier Part Number 3: 1977271; Supplier Part Number 2: LM35DZ/NOPB; Supplier Part Number 1: LM35DZ/NOPB-ND
SW1-SW5 = BUTTON_SMD: Tactile Switch SPST-NO Top Actuated Surface Mount; Manufacturer: ITT C&K; Value: BUTTON; Supplier 1: Digi-Key; Manufacturer Part Number: PTS526SMG15SMTR2LFS; RoHS: No; Category: Tactile Switches; Supplier 2: Digi-Key; Stock 2: 51840; Pricing 2: 1=0,19000, 10=0,18600, 25=0,17640, 100=0,16050, 250=0,15088, 500=0,13804, 1000=0,11556 (USD); Supplier Part Number 1: CKN12222-1-ND; Supplier Part Number 2: CKN12224-1-ND
U1 = 7805: Linear Voltage Regulator IC Positive Fixed 1 Output 5V 1.5A D2PAK; Manufacturer: STMicroelectronics; Number of Outputs: 1; Max Input Voltage: 35V; Quiescent Current: 6mA; Accuracy: 2%; Min Input Voltage: 7V; Dropout Voltage: 2V; Power Supply Rejection Ratio (PSRR): 68dB; Supplier 1: Digi-Key; Manufacturer Part Number: L7805ACD2T-TR; RoHS: Yes; Category: Voltage Regulators - Linear; Stock 1: 2000; Pricing 1: 1=1,08000, 10=0,97000, 25=0,92040, 100=0,75600, 250=0,70672, 500=0,62454 (USD); Mount: Surface Mount; Case/Package: TO-263; Number of Pins: 3; Weight: 7.1E-05oz; Contact Plating: Tin,Matte; Min Operating Temperature: 0°C; Max Operating Temperature: 150°C; Max Output Current: 1.5A; Output Voltage: 5V; Polarity: Positive; Output Type: Fixed; Output Current: 1.5A; Packaging: Cut Tape; Package Quantity: 1000; Nominal Output Voltage: 5V; Number of Regulators: 1; Min Output Voltage: 5V; Output Voltage Accuracy: 2%; Series: L78; Length: 10.4mm; Width: 9.35mm; Height: 4.6mm; Radiation Hardening: No; REACH SVHC: No SVHC; Lead Free: Lead Free; RoHS Compliant: Yes; ComponentLink1URL: https://datasheet.ciiva.com/15111/getdatasheetpartid-69832-15111359.pdf?src-supplier=Verical; ComponentLink1Description: https://datasheet.ciiva.com/15111/getdatasheetpartid-69832-15111359.pdf?src-supplier=Verical; ComponentLink2URL: https://datasheet.ciiva.com/1511/1805459-1511908.pdf?src-supplier=Element14; ComponentLink2Description: https://datasheet.ciiva.com/1511/1805459-1511908.pdf?src-supplier=Element14; ComponentLink3URL: https://datasheet.ciiva.com/2042/cd00000444-2042978.pdf?src-supplier=Digi-Key; ComponentLink3Description: https://datasheet.ciiva.com/2042/cd00000444-2042978.pdf?src-supplier=Digi-Key; ComponentLink4URL: https://datasheet.ciiva.com/2042/cd00000444-2042977.pdf?src-supplier=Digi-Key; ComponentLink4Description: https://datasheet.ciiva.com/2042/cd00000444-2042977.pdf?src-supplier=Digi-Key; ComponentLink5URL: https://datasheet.ciiva.com/2042/cd00000444-2042979.pdf?src-supplier=Digi-Key; ComponentLink5Description: https://datasheet.ciiva.com/2042/cd00000444-2042979.pdf?src-supplier=Digi-Key; ComponentLink6URL: https://datasheet.ciiva.com/16353/cd00000444-16353997.pdf?src-supplier=Future+Electronics; ComponentLink6Description: https://datasheet.ciiva.com/16353/cd00000444-16353997.pdf?src-supplier=Future+Electronics; Supplier Part Number 1: 497-7253-1-ND
U2 = AP7361-33E-13: AP7361 Series 3.3 V 1 A Low SMT Dropout Fixed-Mode Regulator - SOT-223
U3 = DS1302_SMD: IC RTC CLK/CALENDAR SER 8-SOIC; Manufacturer: Maxim; Manufacturer Part Number: DS1302Z/T&R; Time Format: HH:MM:SS (12/24 hr); Memory Size: 31B; Supplier 1: Digi-Key; RoHS: No; Category: Real Time Clocks; Case/Package: SOIC; Number of Pins: 8; Min Operating Temperature: 0°C; Max Operating Temperature: 70°C; Lead Free: Contains Lead; RoHS Compliant: No; ComponentLink1URL: https://datasheet.ciiva.com/1243/ds1302-1243262.pdf?src-supplier=Digi-Key; ComponentLink1Description: https://datasheet.ciiva.com/1243/ds1302-1243262.pdf?src-supplier=Digi-Key; Supplier Part Number 1: DS1302Z/T&R-ND
U4 = PIC16F877/A_SMD: PIC16F Series 14 kB Flash 368 B RAM 20 MHz 8-Bit Microcontroller - TQFP-44; Manufacturer: Microchip; Number of PWM Channels: 2; RAM Size: 368B; Max Power Dissipation: 1W; Interface: I2C,SPI,UART,USART,SSP; Number of Timers/Counters: 3; Min Supply Voltage: 4V; Max Supply Voltage: 5.5V; Frequency: 20MHz; Number of UART Channels: 1; Data Bus Width: 8b; Number of Programmable I/O: 33; Oscillator Type: External; Memory Size: 14KB; Number of Bits: 8; Watchdog Timer: Yes; Access Time: 20us; Peripherals: PWM,I2C,Brown-out Detect/Reset,POR,WDT; Core Architecture: PIC; Operating Supply Voltage: 5V; Number of USB Channels: 0; Supplier 1: Digi-Key; Manufacturer Part Number: PIC16F877-20/PT; RoHS: Yes; Category: Microcontrollers; Case/Package: TQFP; Number of Pins: 44; Contact Plating: Tin,Matte; Min Operating Temperature: 0°C; Max Operating Temperature: 70°C; Package Quantity: 160; Packaging: Tray; Memory Type: FLASH; Max Frequency: 20MHz; Number of A/D Converters: 1; Number of I/Os: 33; Number of ADC Channels: 8; Number of SPI Channels: 1; Number of I2C Channels: 1; Termination: SMD/SMT; Length: 0.397inch; Width: 0.398inch; Height: 0.041inch; Lead Pitch: 0.5mm; Radiation Hardening: No; Lead Free: Lead Free; RoHS Compliant: Yes; REACH SVHC: No SVHC; ComponentLink1URL: https://datasheet.ciiva.com/4839/30292c-55665-4839243.pdf?src-supplier=Mouser; ComponentLink1Description: https://datasheet.ciiva.com/4839/30292c-55665-4839243.pdf?src-supplier=Mouser; ComponentLink2URL: https://datasheet.ciiva.com/14561/70045624-14561738.pdf?src-supplier=Allied+Electronics; ComponentLink2Description: https://datasheet.ciiva.com/14561/70045624-14561738.pdf?src-supplier=Allied+Electronics; ComponentLink3URL: https://datasheet.ciiva.com/7774/30292c-7774269.pdf?src-supplier=Element14; ComponentLink3Description: https://datasheet.ciiva.com/7774/30292c-7774269.pdf?src-supplier=Element14; ComponentLink4URL: https://datasheet.ciiva.com/3203/30292c-3203495.pdf?src-supplier=Avnet; ComponentLink4Description: https://datasheet.ciiva.com/3203/30292c-3203495.pdf?src-supplier=Avnet; ComponentLink5URL: https://datasheet.ciiva.com/16371/filehandler-aspxddocname-en011185-16371133.pdf?src-supplier=Future+Electronics; ComponentLink5Description: https://datasheet.ciiva.com/16371/filehandler-aspxddocname-en011185-16371133.pdf?src-supplier=Future+Electronics; ComponentLink6URL: https://datasheet.ciiva.com/15199/getdatasheetpartid-423006-15199867.pdf?src-supplier=Verical; ComponentLink6Description: https://datasheet.ciiva.com/15199/getdatasheetpartid-423006-15199867.pdf?src-supplier=Verical; ComponentLink7URL: https://datasheet.ciiva.com/1496/30292c-1496841.pdf?src-supplier=Digi-Key; ComponentLink7Description: https://datasheet.ciiva.com/1496/30292c-1496841.pdf?src-supplier=Digi-Key; Supplier Part Number 1: PIC16F877-20/PT-ND
XTAL1 = CRYSTAL_32.768 KHZ_SMD: ABRACON - ABS05-32.768KHZ-T - Crystal, 32.768 kHz, SMD, 1.6mm x 1mm, 12.5 pF, 20 ppm, ABS05 Series; Frequency Tolerance: 20ppm; Load Capacitance: 12.5pF; ESR (Equivalent Series Resistance): 90kR; Supplier 1: Digi-Key; Manufacturer: Abracon; Manufacturer Part Number: ABS05-32.768KHZ-T; RoHS: Yes; Category: Crystals; Stock 1: 434040; Pricing 1: 1=1,47000, 10=1,40400, 50=1,37080, 100=1,17500, 500=1,14240, 1000=0,96288 (USD); Mount: Surface Mount; Case/Package: SMD/SMT; Number of Pins: 2; Min Operating Temperature: -40°C; Max Operating Temperature: 85°C; Packaging: Tape and Reel; Package Quantity: 3000; Frequency: 32.768kHz; Tolerance: 20ppm; Termination: SMD/SMT; Series Resistance: 90kR; Series: ABS05; Operating Frequency: 32.768 kHz; Length: 1.6mm; Width: 0.039inch; Height: 0.02inch; Depth: 1mm; Radiation Hardening: No; REACH SVHC: No SVHC; Lead Free: Lead Free; RoHS Compliant: Yes; ComponentLink1URL: https://datasheet.ciiva.com/23810/abs05-23810480.pdf?src-supplier=Newark; ComponentLink1Description: https://datasheet.ciiva.com/23810/abs05-23810480.pdf?src-supplier=Newark; ComponentLink2URL: https://datasheet.ciiva.com/6728/abs05-6728949.pdf?src-supplier=Digi-Key; ComponentLink2Description: https://datasheet.ciiva.com/6728/abs05-6728949.pdf?src-supplier=Digi-Key; ComponentLink3URL: https://datasheet.ciiva.com/6728/abs05-6728950.pdf?src-supplier=Digi-Key; ComponentLink3Description: https://datasheet.ciiva.com/6728/abs05-6728950.pdf?src-supplier=Digi-Key; ComponentLink4URL: https://datasheet.ciiva.com/16411/abs05-16411149.pdf?src-supplier=Future+Electronics; ComponentLink4Description: https://datasheet.ciiva.com/16411/abs05-16411149.pdf?src-supplier=Future+Electronics; Supplier Part Number 1: 535-11899-1-ND
XTAL2 = CRYSTAL_20 MHZ_20PF_2 SMD: 20 MHz ±30ppm Crystal 20pF 30 Ohms 2-SMD, No Lead; Manufacturer: ECS International; Frequency Stability: 50ppm; ESR (Equivalent Series Resistance): 30R; Supplier 1: Digi-Key; Manufacturer Part Number: ECS-200-20-23A-EN-TR; RoHS: Yes; Category: Crystals; Stock 1: 8445; Pricing 1: 1=1,14000, 10=1,08600, 50=1,06040, 100=0,90900, 500=0,88376 (USD); Mount: Surface Mount; Case/Package: SMD/SMT; Min Operating Temperature: -40°C; Max Operating Temperature: 85°C; Termination: SMD/SMT; Frequency: 20MHz; Package Quantity: 1; Frequency Tolerance: 30ppm; Packaging: Tape and Reel; Load Capacitance: 20pF; Length: 0.236inch; Width: 0.138inch; Height: 0.043inch; Lead Free: Lead Free; ComponentLink1URL: https://datasheet.ciiva.com/859/ecx-64aen-ecx-64cen-859395.pdf?src-supplier=Digi-Key; ComponentLink1Description: https://datasheet.ciiva.com/859/ecx-64aen-ecx-64cen-859395.pdf?src-supplier=Digi-Key; ComponentLink2URL: https://datasheet.ciiva.com/859/ecx-64aen-ecx-64cen-859396.pdf?src-supplier=Digi-Key; ComponentLink2Description: https://datasheet.ciiva.com/859/ecx-64aen-ecx-64cen-859396.pdf?src-supplier=Digi-Key; ComponentLink3URL: https://datasheet.ciiva.com/859/ecx-64aen-ecx-64cen-859397.pdf?src-supplier=Digi-Key; ComponentLink3Description: https://datasheet.ciiva.com/859/ecx-64aen-ecx-64cen-859397.pdf?src-supplier=Digi-Key; Supplier Part Number 1: XC988CT-ND